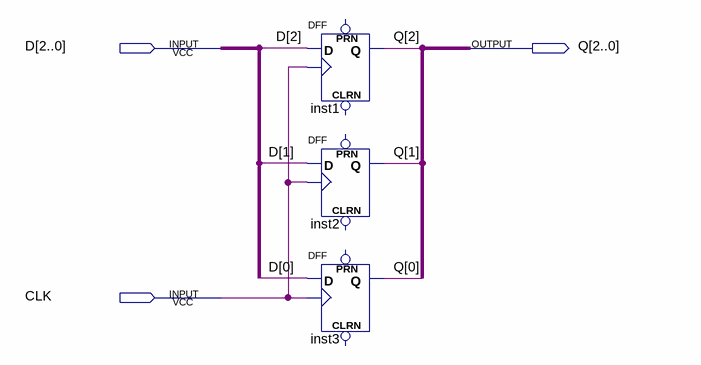
[diagram p0: schematic sheet]
// Quartus schematic ctrDFFs.bdf as structural Verilog: 3 symbols, 3 pins
module ctrDFFs (
  input  [2:0] D,
  input  CLK,
  output [2:0] Q
);

  DFF inst1 (.CLK(CLK), .D(D[2]), .Q(Q[2]));  // open: CLRN, PRN
  DFF inst2 (.CLK(CLK), .D(D[1]), .Q(Q[1]));  // open: CLRN, PRN
  DFF inst3 (.CLK(CLK), .D(D[0]), .Q(Q[0]));  // open: CLRN, PRN
endmodule
